# Altium schematic sheet fpga_io_bank_0.SchDoc: FPGA bank 0
size 297 x 209 mm; CheckedBy: MC, TW, EB; CompanyName: CERN; DrawnBy: Greg Kasprowicz; Organization: CERN; Address1: European Organization for Nuclear Research; Address2: CH-1211 Geneve 23 - Switzerland; DocumentNumber: 5; Revision: -; SheetNumber: 5; SheetTotal: 17; EDA_Number: EDA-02189-V4-0; Projet: Simple PCIe Carrier Board; ModifiedBy: TW, MC; CreateDate: 10/07/2010; CheckedDate: 11/05/2011; Title2: Misc. connections; DivGrp: BE-CO; Designer: GK, MC, TW, EB, PAS; ModifiedDate: -
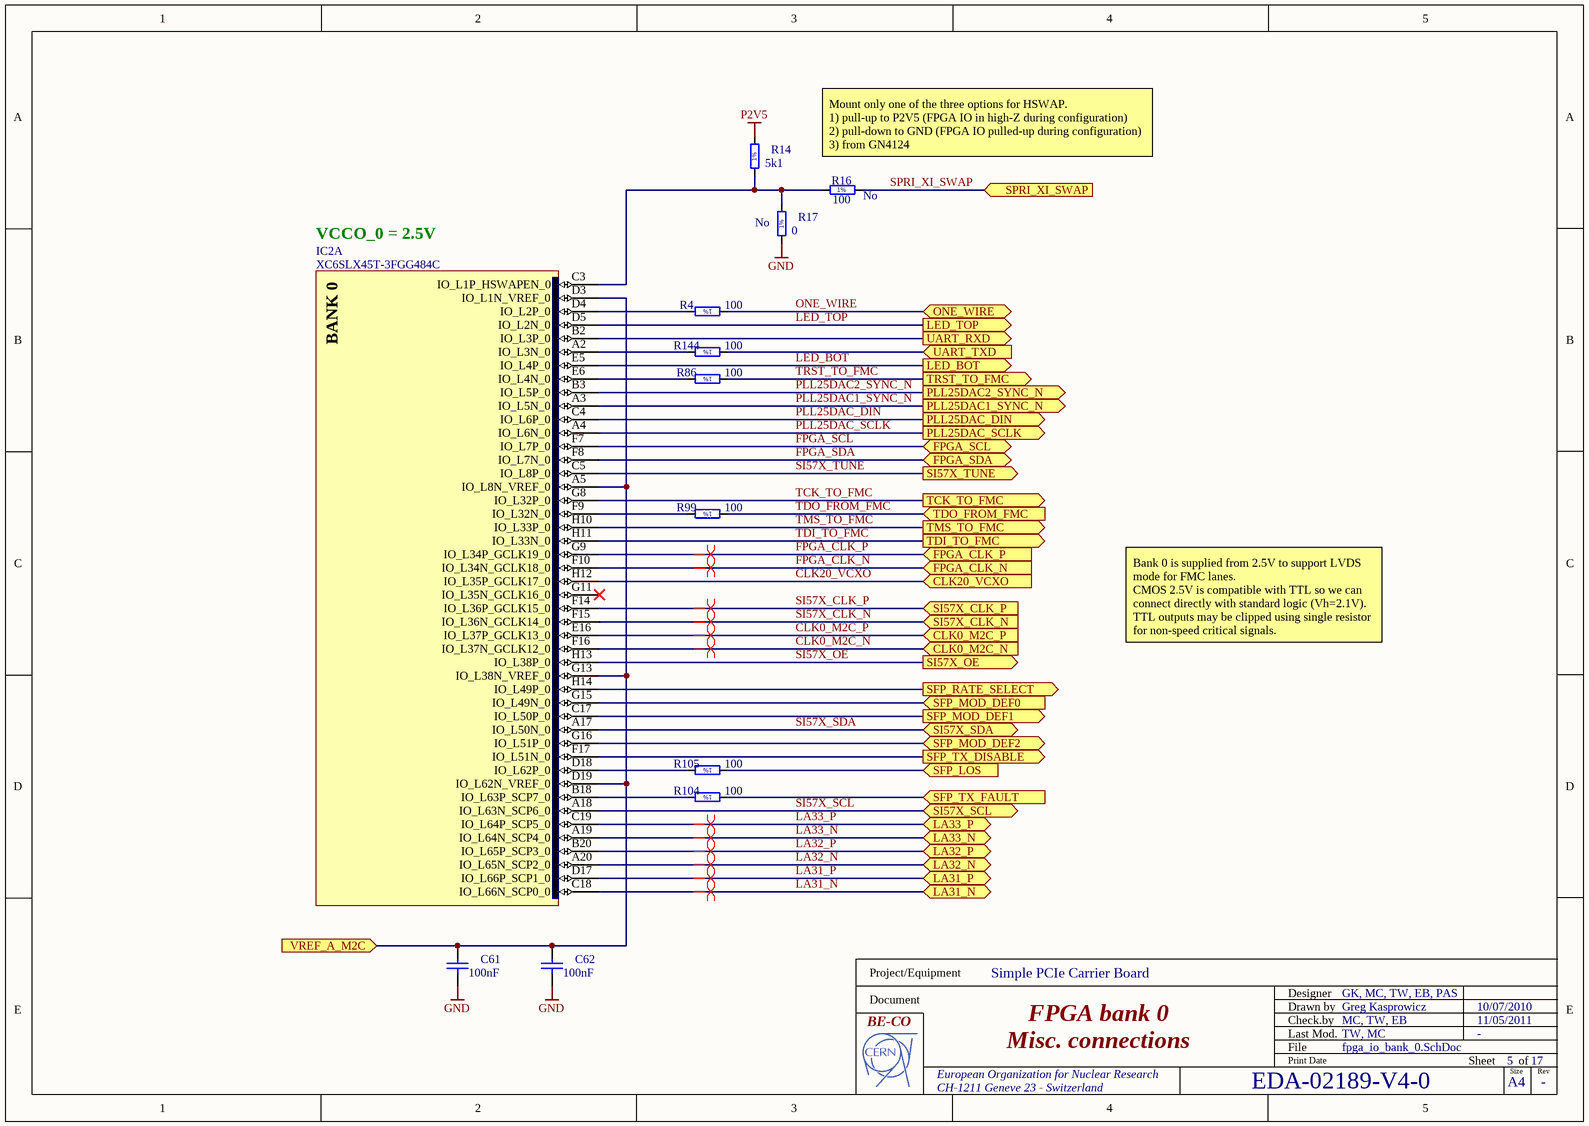
[diagram p0: fpga_io_bank_0.SchDoc]

## Parts
C61  100nF  [CAPC1005X55N]
C62  100nF  [CAPC1005X55N]
IC2  XC6SLX45T-3FGG484C  [BGA484C100P22X22_2300X2300X260]  (part A of 9)
R4  100  [RESC1608X55N]
R14  5k1  [RESC1608X55N]
R16  100  Mounted: No  [RESC1608X55N]
R17  0  Mounted: No  [RESC1608X55N]
R86  100  [RESC1608X55N]
R99  100  [RESC1608X55N]
R104  100  [RESC1608X55N]
R105  100  [RESC1608X55N]
R144  100  [RESC1608X55N]

## Ports
CLK0_M2C_N (in), CLK0_M2C_P (in), CLK20_VCXO (in), FPGA_CLK_N (in), FPGA_CLK_P (in), FPGA_SCL (bidir), FPGA_SDA (bidir), LA31_N (bidir), LA31_P (bidir), LA32_N (bidir), LA32_P (bidir), LA33_N (bidir), LA33_P (bidir), LED_BOT (out), LED_TOP (out), ONE_WIRE (bidir), PLL25DAC1_SYNC_N (out), PLL25DAC2_SYNC_N (out), PLL25DAC_DIN (out), PLL25DAC_SCLK (out), SFP_LOS (in), SFP_MOD_DEF0 (in), SFP_MOD_DEF1 (out), SFP_MOD_DEF2 (bidir), SFP_RATE_SELECT (out), SFP_TX_DISABLE (out), SFP_TX_FAULT (in), SI57X_CLK_N (in), SI57X_CLK_P (in), SI57X_OE (out), SI57X_SCL (bidir), SI57X_SDA (bidir), SI57X_TUNE (out), SPRI_XI_SWAP (in), TCK_TO_FMC (out), TDI_TO_FMC (out), TDO_FROM_FMC (in), TMS_TO_FMC (out), TRST_TO_FMC (out), UART_RXD (out), UART_TXD (in), VREF_A_M2C (in)

## Nets
GND: C61.1 C62.1 R17.1
P2V5: R14.2
CLK0_M2C_N: IC2.F16(IO_L37N_GCLK12_0) ; port CLK0_M2C_N
CLK0_M2C_P: IC2.E16(IO_L37P_GCLK13_0) ; port CLK0_M2C_P
CLK20_VCXO: IC2.H12(IO_L35P_GCLK17_0) ; port CLK20_VCXO
FPGA_CLK_N: IC2.F10(IO_L34N_GCLK18_0) ; port FPGA_CLK_N
FPGA_CLK_P: IC2.G9(IO_L34P_GCLK19_0) ; port FPGA_CLK_P
FPGA_SCL: IC2.F7(IO_L7P_0) ; port FPGA_SCL
FPGA_SDA: IC2.F8(IO_L7N_0) ; port FPGA_SDA
LA31_N: IC2.C18(IO_L66N_SCP0_0) ; port LA31_N
LA31_P: IC2.D17(IO_L66P_SCP1_0) ; port LA31_P
LA32_N: IC2.A20(IO_L65N_SCP2_0) ; port LA32_N
LA32_P: IC2.B20(IO_L65P_SCP3_0) ; port LA32_P
LA33_N: IC2.A19(IO_L64N_SCP4_0) ; port LA33_N
LA33_P: IC2.C19(IO_L64P_SCP5_0) ; port LA33_P
LED_BOT: IC2.E5(IO_L4P_0) ; port LED_BOT
LED_TOP: IC2.D5(IO_L2N_0) ; port LED_TOP
ONE_WIRE: R4.1 ; port ONE_WIRE
PLL25DAC1_SYNC_N: IC2.A3(IO_L5N_0) ; port PLL25DAC1_SYNC_N
PLL25DAC2_SYNC_N: IC2.B3(IO_L5P_0) ; port PLL25DAC2_SYNC_N
PLL25DAC_DIN: IC2.C4(IO_L6P_0) ; port PLL25DAC_DIN
PLL25DAC_SCLK: IC2.A4(IO_L6N_0) ; port PLL25DAC_SCLK
SFP_LOS: R105.1 ; port SFP_LOS
SFP_MOD_DEF0: IC2.G15(IO_L49N_0) ; port SFP_MOD_DEF0
SFP_MOD_DEF1: IC2.C17(IO_L50P_0) ; port SFP_MOD_DEF1
SFP_MOD_DEF2: IC2.G16(IO_L51P_0) ; port SFP_MOD_DEF2
SFP_RATE_SELECT: IC2.H14(IO_L49P_0) ; port SFP_RATE_SELECT
SFP_TX_DISABLE: IC2.F17(IO_L51N_0) ; port SFP_TX_DISABLE
SFP_TX_FAULT: R104.1 ; port SFP_TX_FAULT
SI57X_CLK_N: IC2.F15(IO_L36N_GCLK14_0) ; port SI57X_CLK_N
SI57X_CLK_P: IC2.F14(IO_L36P_GCLK15_0) ; port SI57X_CLK_P
SI57X_OE: IC2.H13(IO_L38P_0) ; port SI57X_OE
SI57X_SCL: IC2.A18(IO_L63N_SCP6_0) ; port SI57X_SCL
SI57X_SDA: IC2.A17(IO_L50N_0) ; port SI57X_SDA
SI57X_TUNE: IC2.C5(IO_L8P_0) ; port SI57X_TUNE
SPRI_XI_SWAP: R16.2 ; port SPRI_XI_SWAP
TCK_TO_FMC: IC2.G8(IO_L32P_0) ; port TCK_TO_FMC
TDI_TO_FMC: IC2.H11(IO_L33N_0) ; port TDI_TO_FMC
TDO_FROM_FMC: R99.1 ; port TDO_FROM_FMC
TMS_TO_FMC: IC2.H10(IO_L33P_0) ; port TMS_TO_FMC
TRST_TO_FMC: R86.1 ; port TRST_TO_FMC
UART_RXD: IC2.B2(IO_L3P_0) ; port UART_RXD
UART_TXD: R144.1 ; port UART_TXD
VREF_A_M2C: C61.2 C62.2 IC2.A5(IO_L8N_VREF_0) IC2.D3(IO_L1N_VREF_0) IC2.D19(IO_L62N_VREF_0) IC2.G13(IO_L38N_VREF_0) ; port VREF_A_M2C
NetIC2_A2: IC2.A2(IO_L3N_0) R144.2
NetIC2_B18: IC2.B18(IO_L63P_SCP7_0) R104.2
NetIC2_C3: IC2.C3(IO_L1P_HSWAPEN_0) R14.1 R16.1 R17.2
NetIC2_D4: IC2.D4(IO_L2P_0) R4.2
NetIC2_D18: IC2.D18(IO_L62P_0) R105.2
NetIC2_E6: IC2.E6(IO_L4N_0) R86.2
NetIC2_F9: IC2.F9(IO_L32N_0) R99.2

Not connected (* = marked no-connect by the designer): IC2 G11(IO_L35N_GCLK16_0)*

## Layout directives
differential pair: CLK0_M2C_N, CLK0_M2C_P, FPGA_CLK_N, FPGA_CLK_P, LA31_N, LA31_P, LA32_N, LA32_P, LA33_N, LA33_P, SI57X_CLK_N, SI57X_CLK_P

## Notes on the sheet
- (near R16) Mount only one of the three options for HSWAP.
  1) pull-up to P2V5 (FPGA IO in high-Z during configuration)
  2) pull-down to GND (FPGA IO pulled-up during configuration)
  3) from GN4124
- VCCO_0 = 2.5V
- Bank 0 is supplied from 2.5V to support LVDS mode for FMC lanes.
  CMOS 2.5V is compatible with TTL so we can connect directly with standard logic (Vh=2.1V). TTL outputs may be clipped using single resistor for non-speed critical signals.
- Project/Equipment
- Document
- Designer
- Drawn by
- Check.by
- File
- Last Mod.
- Print Date
- Sheet
- Size
- A4
- of
- Rev
- (in symbol R0603_0R_JUMPER) 1%
- (in symbol R0603_5K1_1%_0.1W_100PPM) 1%
- (in symbol R0603_100R_1%_0.1W_100PPM) 1%
- (in symbol XC6SLX45T-3FGG484C, part A) BANK 0

## Library data of the parts
C61 C62 = CC0402_100NF_16V_10%_X7R: Non-polarised capacitor; Part Description: SMD Multilayer Chip Ceramic Capacitor; Manufacturer: GENERIC; Manufacturer1 Part Number: 223878715649; Voltage: 16V; TC: X7R; Tolerance: ±10%; Table: Capacitors SMD; Part Number: CC0402_100NF_16V_10%_X7R; Component Kind: Standard; Component Type: Standard; Pin Count: 2; Value: 100nF; Status: Not Recommended; Manufacturer Part Number: CC0402_100NF_16V_10%_X7R; Case: 0402; Mounted: Yes; Socket: No; SMD: Yes; Manufacturer1 Example: PHYCOMP; Manufacturer1 ComponentHeight: 0.55mm; HelpURL: \\cern.ch\dfs\Applications\Altium\Datasheets\CC0402_X7R_PHYCOMP.pdf; Author: CERN DEM JLC; CreateDate: 12/3/2007; LatestRevisionDate: 12/3/2007
IC2 = XC6SLX45T-3FGG484C: Spartan-6 LXT 1.2V FPGA, 296 User I/Os, 484-Ball Fine-Pitch BGA (1.0mm Pitch), Speed Grade 3, Commercial Grade, Pb-Free; Manufacturer: XILINX; Table: Logic; Part Number: XC6SLX45T-3FGG484C; Component Kind: Standard; Component Type: Standard; Device: XC6SLX45T-3FGG484C; PackageDescription: BGA,1.00mm pitch,square;484 pin,22 columns X 22 rows,23.00mm X 23.00mm X 2.60mm H; Part Description: Spartan-6 LXT 1.2V FPGA, 296 User I/Os, 484-Ball Fine-Pitch BGA (1.0mm Pitch), Speed Grade 3, Commercial Grade, Pb-Free; Manufacturer Part Number: XC6SLX45T-3FGG484C; Pin Count: 484; Case: BGA484; Mounted: Yes; Socket: No; SMD: Yes; ComponentHeight: 2.6mm; HelpURL: \\cern.ch\dfs\Applications\Altium\Datasheets\XC6SLX45T-3FGG484C.pdf; ComponentLink1URL: \\cern.ch\dfs\Applications\Altium\Datasheets\XC6SLX45T-3FGG484C_Package-Pinouts.pdf; ComponentLink1Description: Package/Pinouts; Author: CERN DEM JLC; CreateDate: 2010-07-08; LatestRevisionDate: 2010-07-08
R4 R16 R86 R99 R104 R105 R144 = R0603_100R_1%_0.1W_100PPM: Resistor - 1%; Part Description: General Purpose Thick Film Chip Resistor; Manufacturer: GENERIC; Manufacturer1 Part Number: NRC06F4700TRF; Power: 0.1W; TC: ±100ppm/°C; Table: Resistors SMD; Part Number: R0603_100R_1%_0.1W_100PPM; Component Kind: Standard; Component Type: Standard; Pin Count: 2; Value: 100; Status: Preferred; Tolerance: ±1%; Manufacturer Part Number: R0603_100R_1%_0.1W_100PPM; Case: 0603; Socket: No; SMD: Yes; Manufacturer1 Example: NIC COMPONENT; Manufacturer1 ComponentHeight: 0.55mm; HelpURL: \\cern.ch\dfs\Applications\Altium\Datasheets\R0603_NIC_NRC.pdf; Author: CERN DEM JLC
  R4 R86 R99 R104 R105 R144: Mounted: Yes; CreateDate: 2007-12-03; LatestRevisionDate: 2008-03-13
  R16: CreateDate: 12/3/2007; LatestRevisionDate: 3/13/2008
R14 = R0603_5K1_1%_0.1W_100PPM: Resistor - 1%; Part Description: General Purpose Thick Film Chip Resistor; Manufacturer: GENERIC; Manufacturer1 Part Number: NRC06F5101TRF; Power: 0.1W; TC: ±100ppm/°C; Table: Resistors SMD; Part Number: R0603_5K1_1%_0.1W_100PPM; Component Kind: Standard; Component Type: Standard; Pin Count: 2; Value: 5k1; Status: Preferred; Tolerance: ±1%; Manufacturer Part Number: R0603_5K1_1%_0.1W_100PPM; Case: 0603; Mounted: Yes; Socket: No; SMD: Yes; Manufacturer1 Example: NIC COMPONENT; Manufacturer1 ComponentHeight: 0.55mm; HelpURL: \\cern.ch\dfs\Applications\Altium\Datasheets\R0603_NIC_NRC.pdf; Author: CERN DEM JLC; CreateDate: 03/12/2007; LatestRevisionDate: 13/03/2008
R17 = R0603_0R_JUMPER: Resistor - 1%; Part Description: 1A (0.05R Max DC Resistance) Zero Ohm Jumper; Manufacturer: GENERIC; Manufacturer1 Part Number: NRC06Z0; Table: Resistors SMD; Part Number: R0603_0R_JUMPER; Component Kind: Standard; Component Type: Standard; Pin Count: 2; Value: 0; Status: Preferred; Manufacturer Part Number: R0603_0R_JUMPER; Case: 0603; Socket: No; SMD: Yes; Manufacturer1 Example: NIC COMPONENT; Manufacturer1 ComponentHeight: 0.55mm; HelpURL: \\cern.ch\dfs\Applications\Altium\Datasheets\R0603_NIC_NRC.pdf; Author: CERN DEM JLC; CreateDate: 12/3/2007; LatestRevisionDate: 3/13/2008